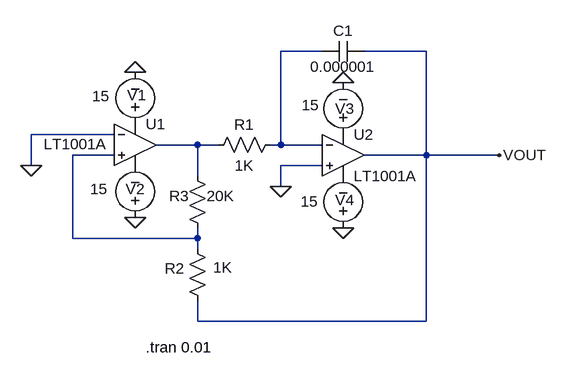
[diagram p0: schematic Triangular Waveform Generator.asc]
Triangular Waveform Generator.asc, the LTspice schematic file:
Version 4
SHEET 1 880 680
WIRE 336 0 272 0
WIRE 496 0 400 0
WIRE 16 128 -112 128
WIRE 144 144 80 144
WIRE 176 144 144 144
WIRE 272 144 272 0
WIRE 272 144 256 144
WIRE 336 144 272 144
WIRE 16 160 -48 160
WIRE 496 160 496 0
WIRE 496 160 400 160
WIRE 608 160 496 160
WIRE -112 176 -112 128
WIRE 336 176 272 176
WIRE 144 192 144 144
WIRE 272 208 272 176
WIRE -48 288 -48 160
WIRE 144 288 144 272
WIRE 144 288 -48 288
WIRE 144 304 144 288
WIRE 144 416 144 384
WIRE 496 416 496 160
WIRE 496 416 144 416
FLAG 368 48 0
FLAG 368 272 0
FLAG 48 256 0
FLAG 48 32 0
FLAG -112 176 0
FLAG 272 208 0
FLAG 608 160 VOUT
SYMBOL OpAmps\\LT1001A 48 80 R0
WINDOW 3 -141 63 Left 2
SYMATTR InstName U1
SYMBOL OpAmps\\LT1001A 368 96 R0
SYMATTR InstName U2
SYMBOL res 272 128 R90
WINDOW 0 0 56 VBottom 2
WINDOW 3 32 56 VTop 2
SYMATTR InstName R1
SYMATTR Value 1K
SYMBOL res 160 288 R180
WINDOW 0 36 -46 Left 2
WINDOW 3 -41 65 Left 2
SYMATTR InstName R2
SYMATTR Value 20K
SYMBOL res 160 400 R180
WINDOW 0 29 177 Left 2
WINDOW 3 -37 67 Left 2
SYMATTR InstName R3
SYMATTR Value 1K
SYMBOL cap 400 -16 R90
WINDOW 0 0 32 VBottom 2
WINDOW 3 24 32 VTop 2
SYMATTR InstName C1
SYMATTR Value 0.000001
SYMBOL voltage 48 128 R180
WINDOW 0 -17 61 Left 2
WINDOW 3 39 59 Left 2
WINDOW 123 0 0 Left 0
WINDOW 39 0 0 Left 0
SYMATTR InstName V1
SYMATTR Value 15
SYMBOL voltage 48 272 R180
WINDOW 0 -15 60 Left 2
WINDOW 3 42 60 Left 2
WINDOW 123 0 0 Left 0
WINDOW 39 0 0 Left 0
SYMATTR InstName V2
SYMATTR Value 15
SYMBOL voltage 368 144 R180
WINDOW 0 -17 56 Left 2
WINDOW 3 37 61 Left 2
WINDOW 123 0 0 Left 0
WINDOW 39 0 0 Left 0
SYMATTR InstName V3
SYMATTR Value 15
SYMBOL voltage 368 288 R180
WINDOW 0 -17 59 Left 2
WINDOW 3 38 57 Left 2
WINDOW 123 0 0 Left 0
WINDOW 39 0 0 Left 0
SYMATTR InstName V4
SYMATTR Value 15
TEXT 64 456 Left 2 !.tran 0.01

The netlist it stands for:
* Triangular Waveform Generator.asc
XU1 N003 0 P001 P002 N002 LT1001  ; LT1001A, pins In+ In- V+ V- OUT
XU2 0 N001 P003 P004 VOUT LT1001  ; LT1001A, pins In+ In- V+ V- OUT
R1 N001 N002 1K
R2 N003 N002 20K
R3 VOUT N003 1K
C1 VOUT N001 0.000001
V1 P001 0 15
V2 0 P002 15
V3 P003 0 15
V4 0 P004 15
.tran 0.01
.lib LTC.lib
.backanno
.end